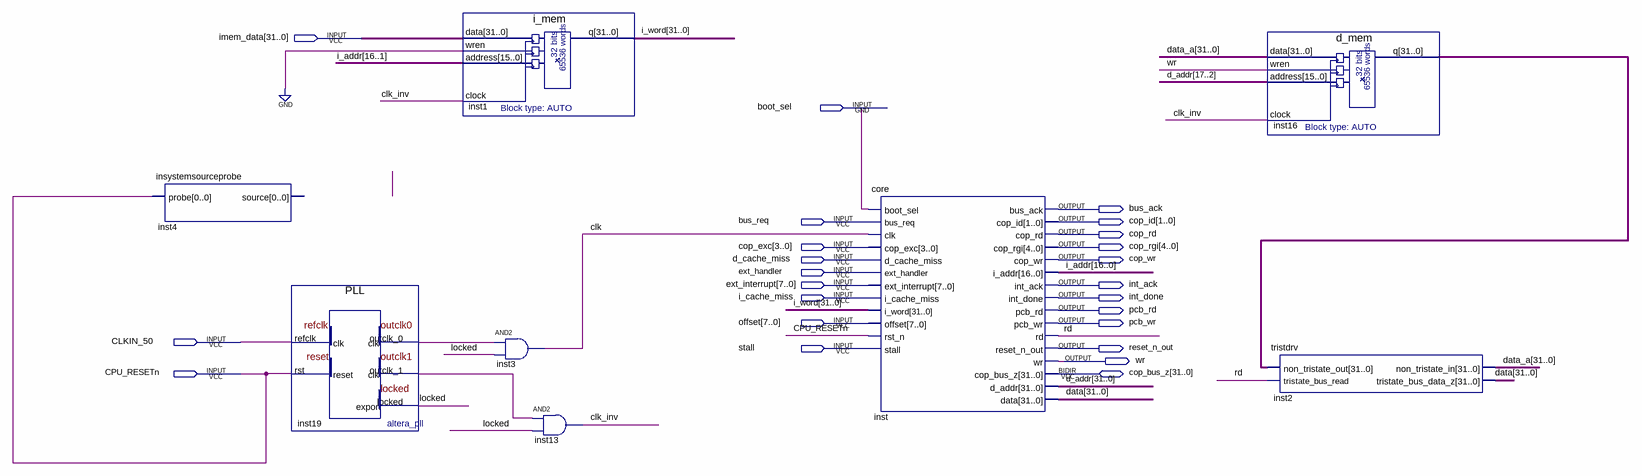
[diagram p0: schematic sheet]
// Quartus schematic Single_Core_Stratix5.bdf as structural Verilog: 8 symbols, 24 pins
module Single_Core_Stratix5 (
  input  [31:0] imem_data,
  input  boot_sel,
  input  bus_req,
  input  [3:0] cop_exc,
  input  d_cache_miss,
  input  ext_handler,
  input  [7:0] ext_interrupt,
  input  i_cache_miss,
  input  [7:0] offset,
  input  CLKIN_50,
  input  stall,
  input  CPU_RESETn,
  inout  [31:0] cop_bus_z,
  output bus_ack,
  output [1:0] cop_id,
  output cop_rd,
  output [4:0] cop_rgi,
  output cop_wr,
  output int_ack,
  output int_done,
  output pcb_rd,
  output pcb_wr,
  output reset_n_out,
  output wr
);

  wire clk, clk_inv, inst19_outclk_0, inst19_outclk_1, locked, rd;
  wire [16:0] i_addr;
  wire [31:0] d_addr, data, data_a, i_word, inst16_q;

  insystemsourceprobe inst4 (.probe(CPU_RESETn));  // open: source
  PLL inst19 (
    .refclk(CLKIN_50), .rst(CPU_RESETn), .outclk_0(inst19_outclk_0), .outclk_1(inst19_outclk_1),
    .locked(locked));
  i_mem inst1 (.data(imem_data), .wren(1'b0), .address(i_addr[16:1]), .clock(clk_inv), .q(i_word));
  and inst3 (clk, inst19_outclk_0, locked);
  and inst13 (clk_inv, inst19_outclk_1, locked);
  core inst (
    .boot_sel(boot_sel), .bus_req(bus_req), .clk(clk), .cop_exc(cop_exc), .d_cache_miss(d_cache_miss),
    .ext_handler(ext_handler), .ext_interrupt(ext_interrupt), .i_cache_miss(i_cache_miss), .i_word(i_word),
    .offset(offset), .rst_n(CPU_RESETn), .stall(stall), .bus_ack(bus_ack), .cop_id(cop_id), .cop_rd(cop_rd),
    .cop_rgi(cop_rgi), .cop_wr(cop_wr), .i_addr(i_addr), .int_ack(int_ack), .int_done(int_done),
    .pcb_rd(pcb_rd), .pcb_wr(pcb_wr), .rd(rd), .reset_n_out(reset_n_out), .wr(wr), .cop_bus_z(cop_bus_z),
    .d_addr(d_addr), .data(data));
  d_mem inst16 (.data(data_a), .wren(wr), .address(d_addr[17:2]), .clock(clk_inv), .q(inst16_q));
  tristdrv inst2 (
    .non_tristate_out(inst16_q), .tristate_bus_read(rd), .non_tristate_in(data_a), .tristate_bus_data_z(data));
endmodule
